# Altium schematic sheet 1.8inch-tft-display.SchDoc
size A4; SheetNumber: 8; SheetTotal: 8
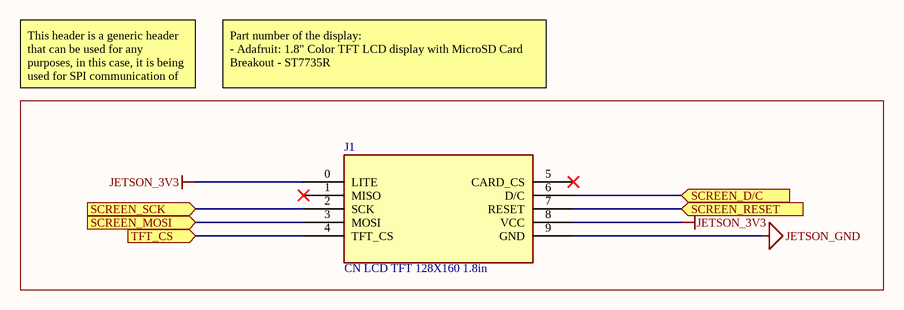
[diagram p0: 1.8inch-tft-display.SchDoc]

## Parts
J1  CN LCD TFT 128X160 1.8in  [CN LCD TFT 128X160 1.8]

## Ports
SCREEN_D/C (in), SCREEN_MOSI (in), SCREEN_RESET (in), SCREEN_SCK (in), TFT_CS (in)

## Nets
JETSON_3V3: J1.0(LITE) J1.8(VCC)
JETSON_GND: J1.9(GND)
SCREEN_D/C: J1.6(D/C) ; port SCREEN_D/C
SCREEN_MOSI: J1.3(MOSI) ; port SCREEN_MOSI
SCREEN_RESET: J1.7(RESET) ; port SCREEN_RESET
SCREEN_SCK: J1.2(SCK) ; port SCREEN_SCK
TFT_CS: J1.4(TFT_CS) ; port TFT_CS

Not connected (* = marked no-connect by the designer): J1 1(MISO)* 5(CARD_CS)*

## Notes on the sheet
- This header is a generic header that can be used for any purposes, in this case, it is being used for SPI communication of the display
- Part number of the display:
  - Adafruit: 1.8" Color TFT LCD display with MicroSD Card Breakout - ST7735R

## Library data of the parts
J1 = CN LCD TFT 128X160 1.8in: Graphic LCD Display Module Transmissive Red, Green, Blue (RGB) TFT - Color SPI 1.8" (45.72mm) 128 x 160; Manufacturer Part Number 1: 358; Part Number: CN LCD TFT 128X160 1.8in; Supplier 1: Digi-Key; Supplier Part Number 1: 1528-1536-ND; Supplier URL 1: https://www.digikey.ca/en/products/detail/adafruit-industries-llc/358/5801368; Pin Count: 10